# Altium schematic sheet SOM_Console.SchDoc
size 420 x 297 mm; SheetNumber: 9; SheetTotal: 19
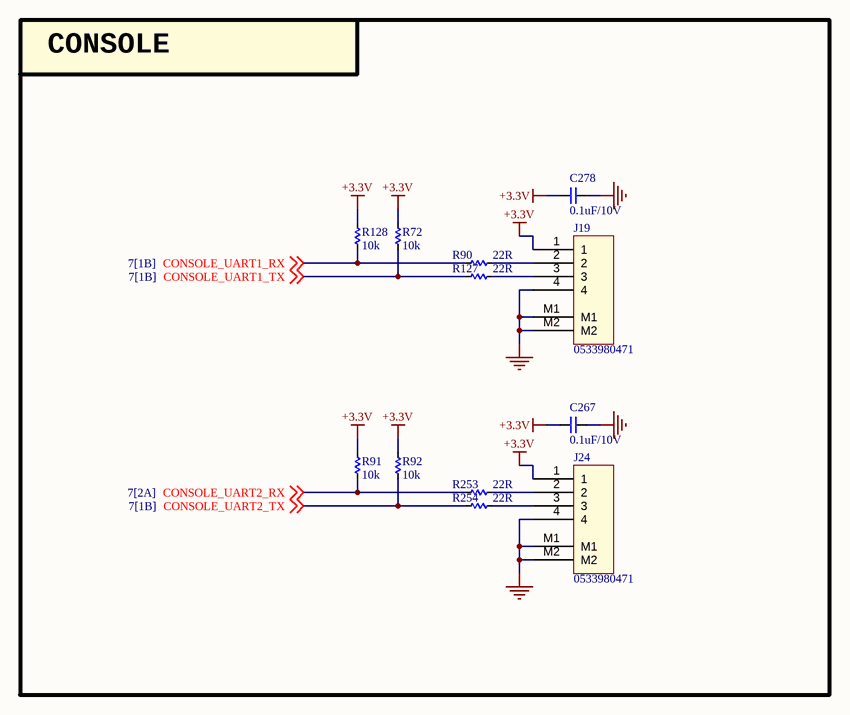
[diagram p0: SOM_Console.SchDoc]

## Parts
C267  0.1uF/10V  [CAP_C_1005X60]
C278  0.1uF/10V  [CAP_C_1005X60]
J19  0533980471  [MOLEX_0533980471]
J24  0533980471  [MOLEX_0533980471]
R72  10k  [RES_C_1005X40]
R90  22R  [RES_C_1005X40]
R91  10k  [RES_C_1005X40]
R92  10k  [RES_C_1005X40]
R127  22R  [RES_C_1005X40]
R128  10k  [RES_C_1005X40]
R253  22R  [RES_C_1005X40]
R254  22R  [RES_C_1005X40]

## Blocks framed on the sheet
CONSOLE: C267 C278 J19 J24 R72 R90-R92 R127 R128 R253 R254

## Nets
+3.3V: C267.2 C278.2 J19.1 J24.1 R72.2 R91.2 R92.2 R128.2
GND: C267.1 C278.1 J19.4 J19.M1 J19.M2 J24.4 J24.M1 J24.M2
CONSOLE_UART1_RX: R90.2 R128.1 ; off-sheet CONSOLE_UART1_RX
CONSOLE_UART1_TX: R72.1 R127.2 ; off-sheet CONSOLE_UART1_TX
CONSOLE_UART2_RX: R91.1 R253.2 ; off-sheet CONSOLE_UART2_RX
CONSOLE_UART2_TX: R92.1 R254.2 ; off-sheet CONSOLE_UART2_TX
NetJ19_2: J19.2 R90.1
NetJ19_3: J19.3 R127.1
NetJ24_2: J24.2 R253.1
NetJ24_3: J24.3 R254.1

## Notes on the sheet
- Project:
- Sub-system:
- Design by:
- Sheet title:
- Sheet
- of
- Checked by:
- Approved by:
- Revision:
- Document No:
- Size:
- Date:
- A3

## Library data of the parts
C267 C278 = _CAP_C_2: CAP CHIP
J19 J24 = Header 4x1_2M
R72 R90-R92 R127 R128 R253 R254 = _RES_B_2: RES